# EAGLE design busadapt-revision-A (EAGLE 6.6.0)
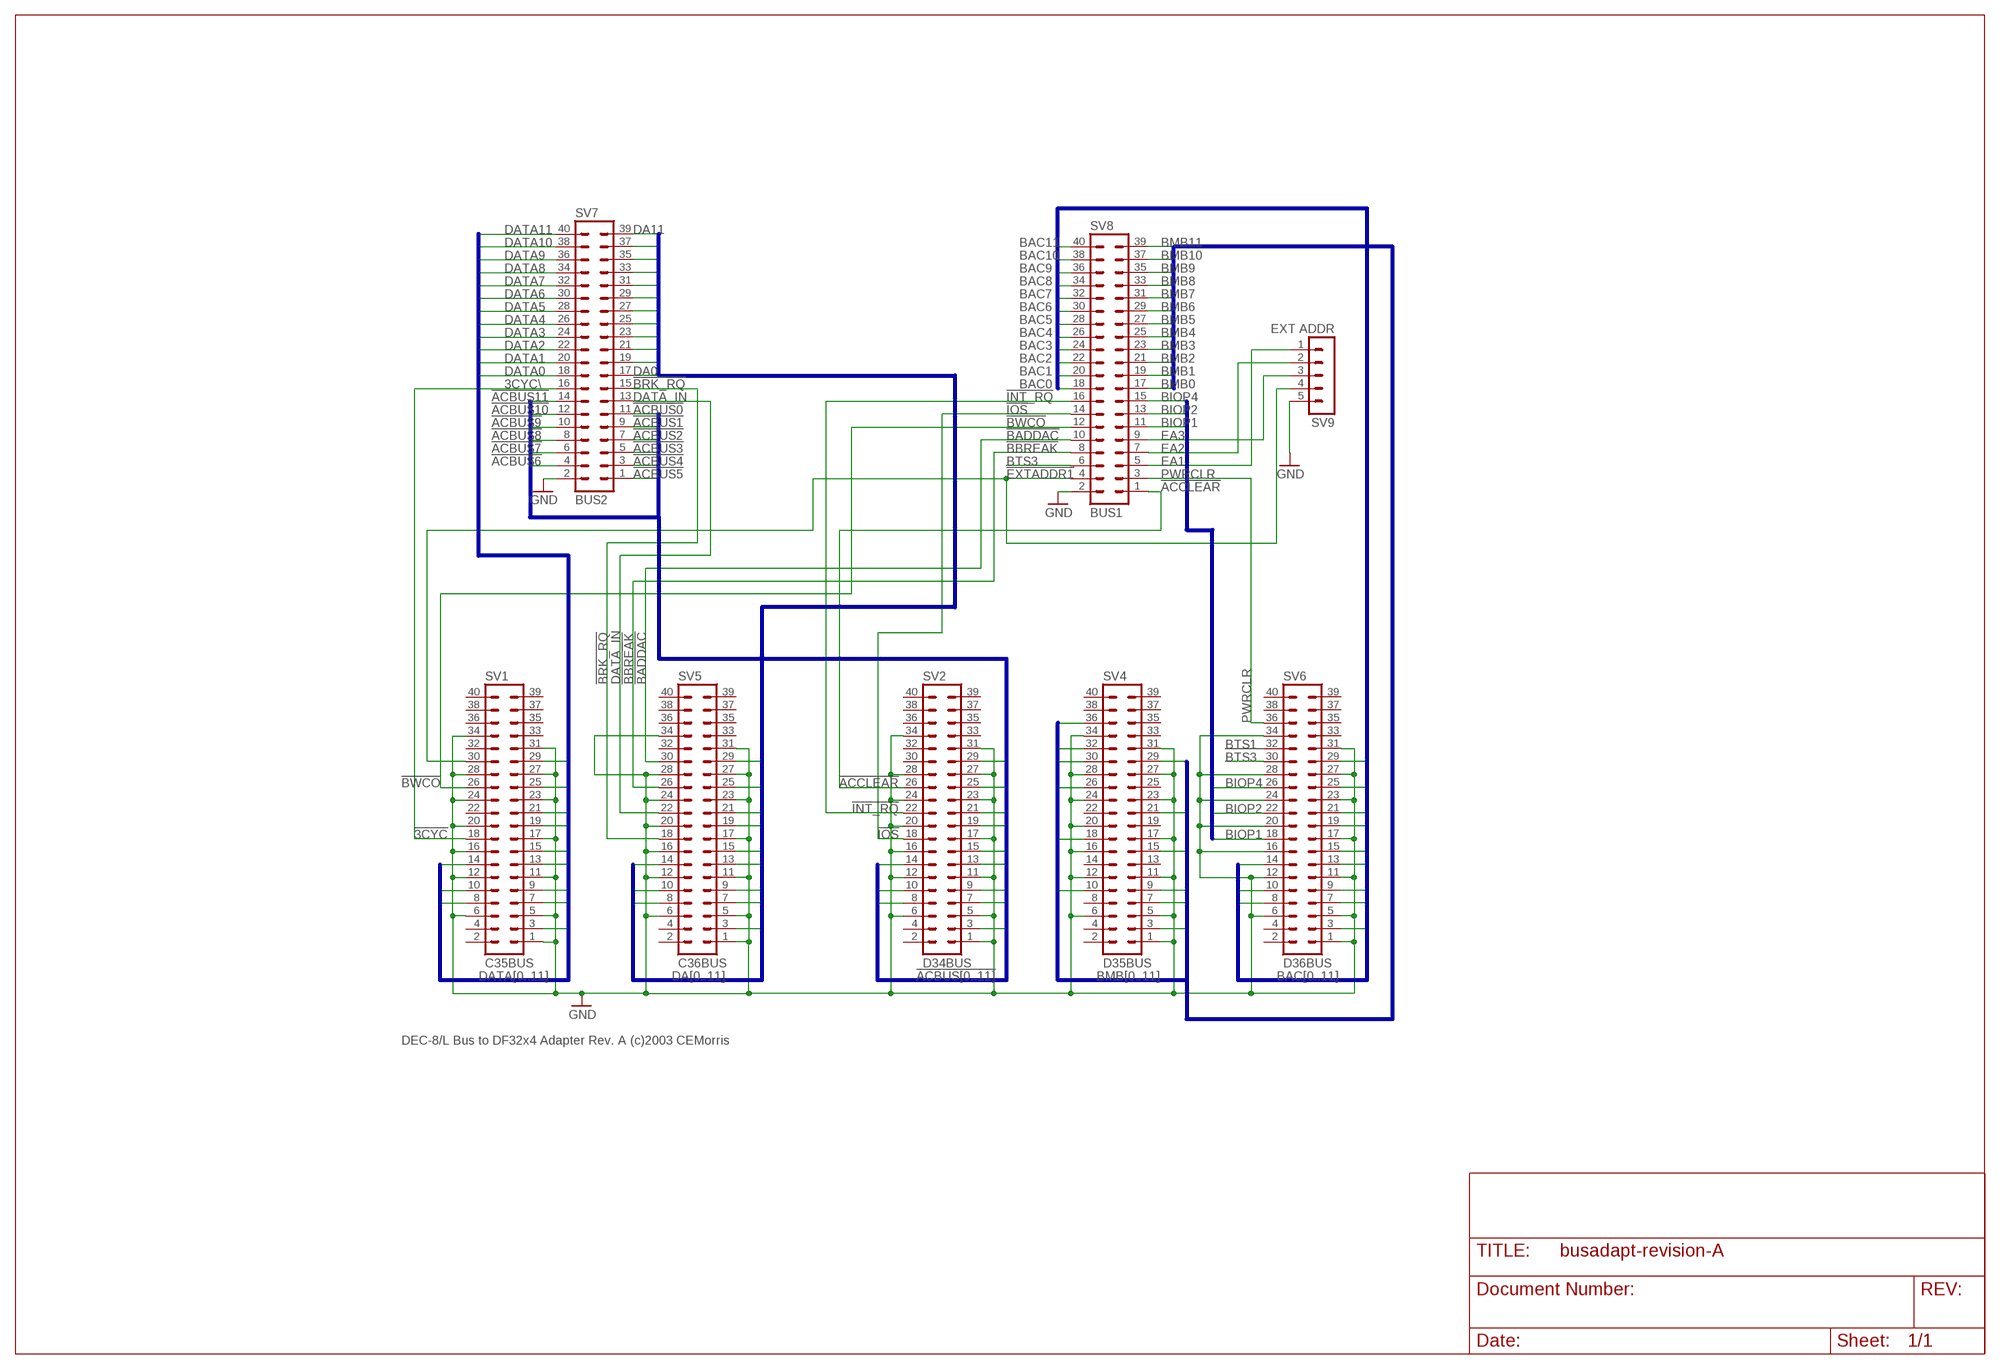
[diagram p0: schematic, sheet 1]

## Parts
SV1  C35BUS  MA20-2  [MA20-2]
SV2  D34BUS  MA20-2  [MA20-2]
SV4  D35BUS  MA20-2  [MA20-2]
SV5  C36BUS  MA20-2  [MA20-2]
SV6  D36BUS  MA20-2  [MA20-2]
SV7  BUS2  MA20-2  [MA20-2]
SV8  BUS1  MA20-2  [MA20-2]
SV9  EXT ADDR  MA05-1  [MA05-1]

## Nets
!3CYC: SV1.18 SV7.16
!ACBUS0: SV2.3 SV7.11
!ACBUS1: SV2.7 SV7.9
!ACBUS2: SV2.9 SV7.7
!ACBUS3: SV2.13 SV7.5
!ACBUS4: SV2.15 SV7.3
!ACBUS5: SV2.19 SV7.1
!ACBUS6: SV2.21 SV7.4
!ACBUS7: SV2.25 SV7.6
!ACBUS8: SV2.29 SV7.8
!ACBUS9: SV2.8 SV7.10
!ACBUS10: SV2.10 SV7.12
!ACBUS11: SV2.14 SV7.14
!ACCLEAR: SV2.26 SV8.1
!BADDAC: SV5.30 SV8.10
!BBREAK: SV5.26 SV8.8
!BRK_RQ: SV5.18 SV7.15
!BWCO: SV1.26 SV8.12
!EXTADDR1: SV1.30 SV8.4 SV9.4
!INT_RQ: SV2.22 SV8.16
!IOS: SV2.18 SV8.14
BAC0: SV6.3 SV8.18
BAC1: SV6.7 SV8.20
BAC2: SV6.9 SV8.22
BAC3: SV6.13 SV8.24
BAC4: SV6.15 SV8.26
BAC5: SV6.19 SV8.28
BAC6: SV6.21 SV8.30
BAC7: SV6.25 SV8.32
BAC8: SV6.29 SV8.34
BAC9: SV6.8 SV8.36
BAC10: SV6.10 SV8.38
BAC11: SV6.14 SV8.40
BIOP1: SV6.18 SV8.11
BIOP2: SV6.22 SV8.13
BIOP4: SV6.26 SV8.15
BMB0: SV4.3 SV8.17
BMB1: SV4.7 SV8.19
BMB2: SV4.9 SV8.21
BMB3: SV4.15 SV8.23
BMB4: SV4.21 SV8.25
BMB5: SV4.29 SV8.27
BMB6: SV4.10 SV8.29
BMB7: SV4.18 SV8.31
BMB8: SV4.26 SV8.33
BMB9: SV4.30 SV8.35
BMB10: SV4.32 SV8.37
BMB11: SV4.36 SV8.39
BTS3: SV6.30 SV8.6
DA0: SV5.3 SV7.17
DA1: SV5.7 SV7.19
DA2: SV5.9 SV7.21
DA3: SV5.13 SV7.23
DA4: SV5.15 SV7.25
DA5: SV5.19 SV7.27
DA6: SV5.21 SV7.29
DA7: SV5.25 SV7.31
DA8: SV5.29 SV7.33
DA9: SV5.8 SV7.35
DA10: SV5.10 SV7.37
DA11: SV5.14 SV7.39
DATA0: SV1.3 SV7.18
DATA1: SV1.7 SV7.20
DATA2: SV1.9 SV7.22
DATA3: SV1.13 SV7.24
DATA4: SV1.15 SV7.26
DATA5: SV1.19 SV7.28
DATA6: SV1.21 SV7.30
DATA7: SV1.25 SV7.32
DATA8: SV1.29 SV7.34
DATA9: SV1.8 SV7.36
DATA10: SV1.10 SV7.38
DATA11: SV1.14 SV7.40
DATA_IN: SV5.22 SV7.13
EA1: SV8.5 SV9.1
EA2: SV8.7 SV9.2
EA3: SV8.9 SV9.3
GND: SV1.1 SV1.5 SV1.6 SV1.11 SV1.12 SV1.16 SV1.17 SV1.20 SV1.23 SV1.24 SV1.27 SV1.28 SV1.31 SV1.34 SV2.1 SV2.5 SV2.6 SV2.11 SV2.12 SV2.16 SV2.17 SV2.20 SV2.23 SV2.24 SV2.27 SV2.28 SV2.31 SV2.34 SV4.1 SV4.5 SV4.6 SV4.11 SV4.12 SV4.16 SV4.17 SV4.20 SV4.23 SV4.24 SV4.27 SV4.28 SV4.31 SV4.34 SV5.1 SV5.5 SV5.6 SV5.11 SV5.12 SV5.16 SV5.17 SV5.20 SV5.23 SV5.24 SV5.27 SV5.28 SV5.31 SV5.34 SV6.1 SV6.5 SV6.6 SV6.11 SV6.12 SV6.16 SV6.17 SV6.20 SV6.23 SV6.24 SV6.27 SV6.28 SV6.31 SV6.34 SV7.2 SV8.2 SV9.5
PWRCLR: SV6.36 SV8.3
Unconnected: SV1.2 SV1.4 SV1.22 SV1.32 SV1.33 SV1.35 SV1.36 SV1.37 SV1.38 SV1.39 SV1.40 SV2.2 SV2.4 SV2.30 SV2.32 SV2.33 SV2.35 SV2.36 SV2.37 SV2.38 SV2.39 SV2.40 SV4.2 SV4.4 SV4.8 SV4.13 SV4.14 SV4.19 SV4.22 SV4.25 SV4.33 SV4.35 SV4.37 SV4.38 SV4.39 SV4.40 SV5.2 SV5.4 SV5.32 SV5.33 SV5.35 SV5.36 SV5.37 SV5.38 SV5.39 SV5.40 SV6.2 SV6.4 SV6.32 SV6.33 SV6.35 SV6.37 SV6.38 SV6.39 SV6.40

## Buses
DA[0..11]
BAC[0..11]
DATA[0..11]
BMB[0..11]
BIOP[1..4]
!ACBUS[0..11]

## Notes on the sheet
- DA11
- DA0
- 3CYC\\
- BTS1
- DEC-8/L Bus to DF32x4 Adapter Rev. A (c)2003 CEMorris

## Library data of the parts
SV1 SV2 SV4-SV8 = con-lstb:MA20-2: PIN HEADER; OC_FARNELL: unknown; OC_NEWARK: unknown
SV9 = con-lstb:MA05-1: PIN HEADER; OC_FARNELL: unknown; OC_NEWARK: unknown

## Board
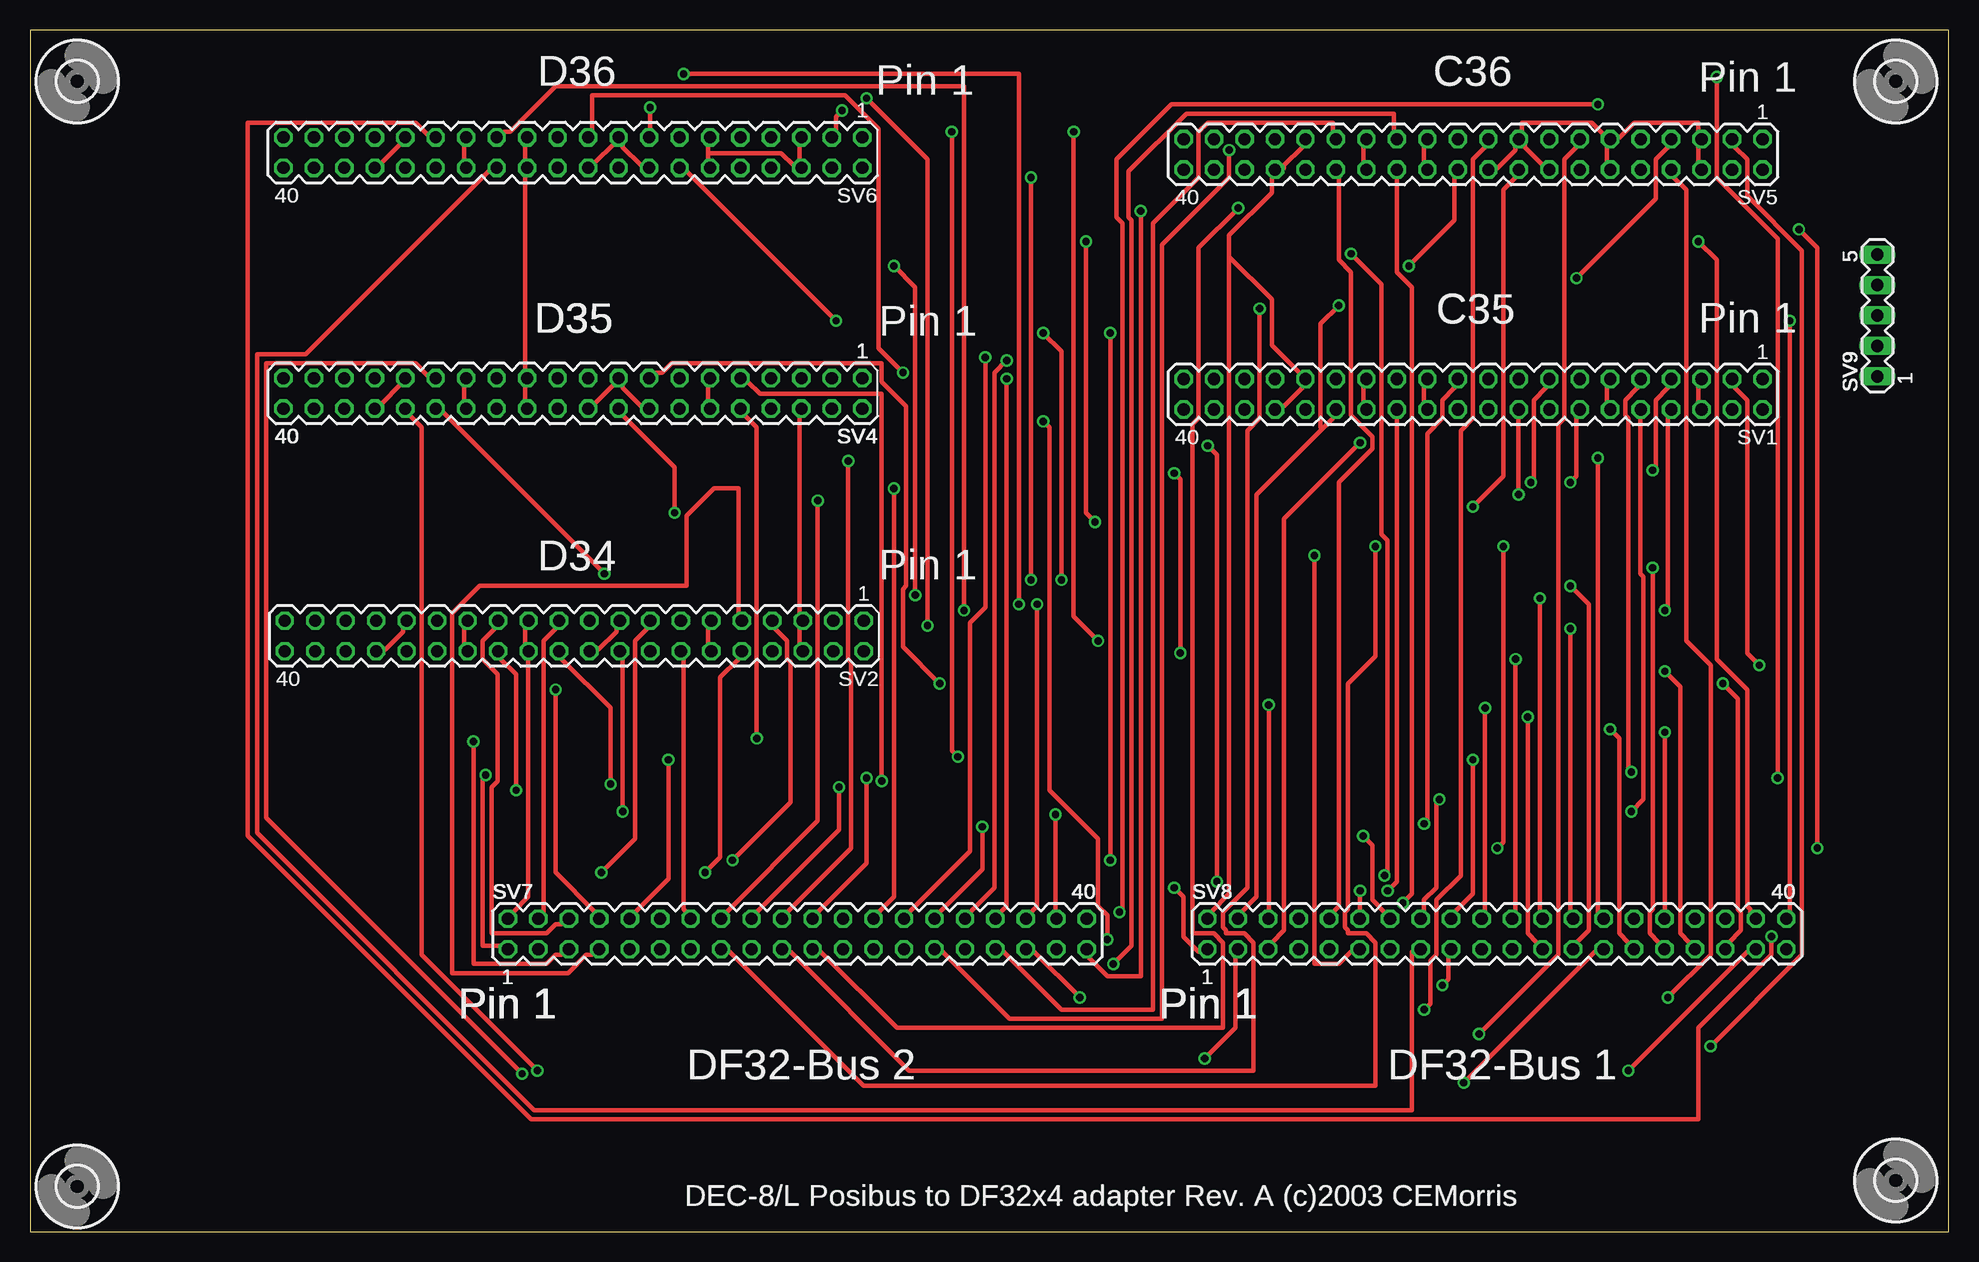
[diagram p1: board, top side]
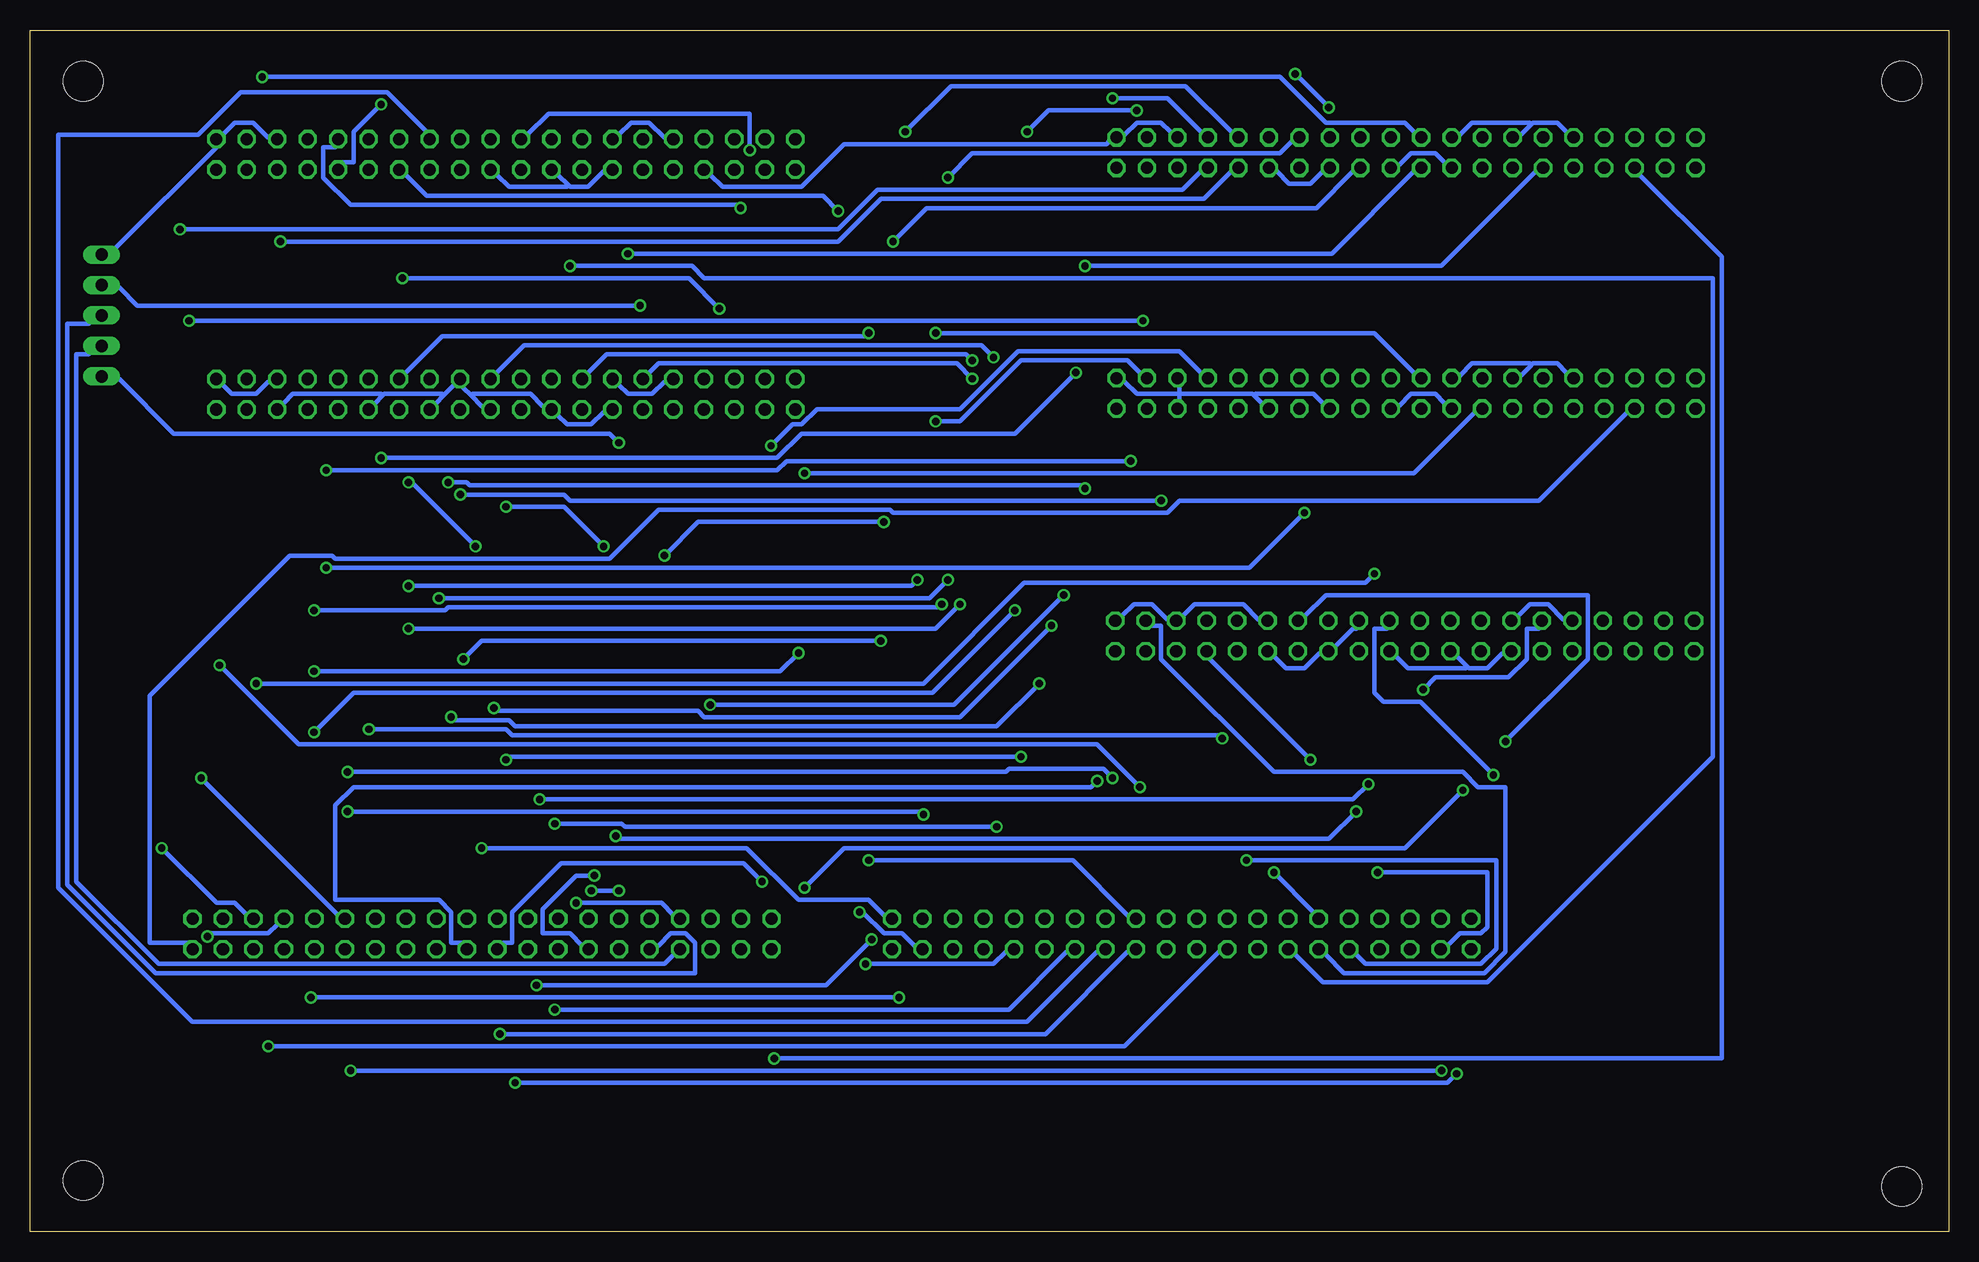
[diagram p2: board, bottom side, seen from below]

Size 159.95 x 100.15 mm. Coordinates in mm from the lower left corner, seen from the top.
Outline: 0,0 159.95,0 159.95,100.15 0,100.15 0,0
Copper layers (1*16): Top 0.035mm / dielectric 1.5mm / Bottom 0.035mm
Design rules "10mils": minimum track width 15mil, minimum drill 24mil, track to track 10mil, track to pad 10mil, pad to pad 10mil, via to via 10mil, smd to smd 10mil, copper to edge 40mil, drill to drill 10mil, minimum pad ring 10mil, minimum via ring 8mil, stop-mask expansion 0mil, vias tented up to drill 0mil, thermal gap 10mil

### Footprints (pad centres in the part's own frame; a part is rotated, then mirrored left to right if it is on the bottom)
MA20-2 = drill 1.016 octagon: 1 -24.13,-1.27; 2 -24.13,1.27; 3 -21.59,-1.27; 4 -21.59,1.27; 5 -19.05,-1.27; 6 -19.05,1.27; 7 -16.51,-1.27; 8 -16.51,1.27; 9 -13.97,-1.27; 10 -13.97,1.27; 11 -11.43,-1.27; 12 -11.43,1.27; 13 -8.89,-1.27; 14 -8.89,1.27; 15 -6.35,-1.27; 16 -6.35,1.27; 17 -3.81,-1.27; 18 -3.81,1.27; 19 -1.27,-1.27; 20 -1.27,1.27; 21 1.27,-1.27; 22 1.27,1.27; 23 3.81,-1.27; 24 3.81,1.27; 25 6.35,-1.27; 26 6.35,1.27; 27 8.89,-1.27; 28 8.89,1.27; 29 11.43,-1.27; 30 11.43,1.27; 31 13.97,-1.27; 32 13.97,1.27; 33 16.51,-1.27; 34 16.51,1.27; 35 19.05,-1.27; 36 19.05,1.27; 37 21.59,-1.27; 38 21.59,1.27; 39 24.13,-1.27; 40 24.13,1.27
MA05-1 = drill 1.016 long: 1 -5.08,0; 2 -2.54,0; 3 0,0; 4 2.54,0; 5 5.08,0
3,3 = hole 3.3: 0,0

### Placement (x,y rotation side)
SV1  120.29,69.79 180 top
SV2  45.36,49.66 180 top
SV4  45.25,69.87 180 top
SV5  120.29,89.79 180 top
SV6  45.25,89.93 180 top
SV7  63.96,24.82 0 top
SV8  122.27,24.82 0 top
SV9  153.98,76.36 90 top
U$1  [3,3]  3.94,3.78 0 top
U$2  [3,3]  3.94,95.87 0 top
U$3  [3,3]  155.52,95.87 0 top
U$4  [3,3]  155.52,4.28 0 top

### Tracks (layer width: path | path; a pad name or v marks a point on that pad's centre or on a via)
!3CYC  (via drill 0.61)
  Top 0.381: v65.66,60.93 65.66,34.26 58.04,26.64 SV7.16 | v124.08,61.44 124.08,67.79 SV1.18
  Bottom 0.381: v65.66,60.93 114.94,60.93 115.45,61.44 v124.08,61.44
!ACBUS0
  Bottom 0.381: SV7.11 51.95,23.08 50.42,21.56 38.74,21.56 36.96,23.34 36.96,37.05 39.25,37.05 40.52,38.32 56.26,38.32 65.66,47.72 65.66,50.52 66.42,50.52 SV2.3
!ACBUS1  (via drill 0.61)
  Top 0.381: v58.55,30.96 63.38,35.78 63.38,47.47 63.12,47.72 63.12,49.25 62.11,50.26 SV2.7
  Bottom 0.381: v58.55,30.96 37.72,30.96 37.72,23.59 38.99,22.32 48.64,22.32 49.41,23.08 SV7.9
!ACBUS2
  Top 0.381: SV7.7 46.87,23.08 46.36,23.08 44.83,21.56 35.18,21.56 35.18,51.53 37.47,53.82 54.74,53.82 54.74,59.66 57.03,61.95 59.06,61.95 59.06,51.53 SV2.9
!ACBUS3  (via drill 0.61)
  Top 0.381: v36.96,40.86 36.96,22.32 43.06,22.32 43.82,23.08 44.33,23.08 SV7.5
  Bottom 0.381: v36.96,40.86 30.1,47.72 30.1,53.06 51.95,53.06 53.72,51.28 SV2.13
!ACBUS4  (via drill 0.61)
  Top 0.381: v47.63,29.94 50.42,32.74 50.42,49.25 51.44,50.26 SV2.15
  Bottom 0.381: v47.63,29.94 38.48,29.94 38.48,25.37 38.99,24.86 40.77,24.86 41.79,23.85 SV7.3
!ACBUS5  (via drill 0.61)
  Top 0.381: v37.98,38.07 37.72,37.82 37.72,23.85 39.25,23.85 SV7.1
  Bottom 0.381: v37.98,38.07 44.07,44.17 47.12,44.17 47.88,44.93 47.88,50.26 46.87,50.26 SV2.19
!ACBUS6
  Top 0.381: SV7.4 42.8,26.64 42.8,49.25 43.82,50.26 SV2.21
!ACBUS7
  Top 0.381: SV7.6 44.33,25.62 43.82,25.62 43.06,24.86 38.48,24.86 38.48,37.05 38.99,37.56 38.99,46.45 37.72,47.72 37.72,49.25 38.74,50.26 SV2.25
!ACBUS8  (via drill 0.61)
  Top 0.381: v43.82,45.18 43.82,29.94 47.12,26.64 SV7.8
  Bottom 0.381: v43.82,45.18 42.8,46.2 36.71,46.2 35.18,47.72 35.18,50.26 34.17,50.26 SV2.29
!ACBUS9  (via drill 0.61)
  Top 0.381: v53.22,39.34 53.22,29.43 50.42,26.64 SV7.10
  Bottom 0.381: v53.22,39.34 61.6,47.72 SV2.8
!ACBUS10  (via drill 0.61)
  Top 0.381: v56.26,29.94 57.53,31.21 57.53,46.2 59.06,47.72 SV2.10
  Bottom 0.381: v56.26,29.94 52.96,26.64 SV7.12
!ACBUS11
  Top 0.381: SV7.14 54.74,26.64 54.49,26.89 54.49,47.72 SV2.14
!ACCLEAR  (via drill 0.61)
  Top 0.381: v40.52,36.8 40.52,46.45 39.25,47.72 SV2.26 | v95.38,28.67 96.14,27.91 96.14,24.61 97.41,23.34 SV8.1
  Bottom 0.381: v40.52,36.8 45.34,31.97 92.08,31.97 v95.38,28.67
!BADDAC
  Top 0.381: SV8.10 108.59,26.64 109.1,27.15 109.1,62.45 111.89,65.25 111.89,66.26 110.11,68.04 110.11,79.98 109.1,81 109.1,87.85 SV5.30
!BBREAK  (via drill 0.61)
  Top 0.381: v114.43,27.4 115.19,28.16 115.19,78.71 113.92,79.98 113.92,87.85 SV5.26
  Bottom 0.381: v114.43,27.4 107.32,27.4 106.3,26.39 SV8.8
!BRK_RQ  (via drill 0.61)
  Top 0.381: v112.14,57.12 112.14,47.98 109.86,45.69 109.86,26.89 109.6,26.64 109.6,25.37 109.86,25.12 109.86,24.86 111.38,24.86 112.14,24.1 112.14,12.16 69.47,12.16 58.3,23.34 SV7.15 | v120.27,60.42 122.81,62.96 122.81,86.84 123.83,87.85 SV5.18
  Bottom 0.381: v112.14,57.12 115.45,60.42 v120.27,60.42
!BWCO  (via drill 0.61)
  Top 0.381: v110.87,28.42 110.87,26.64 SV8.12 | v113.16,28.42 113.92,29.18 113.92,67.79 SV1.26
  Bottom 0.381: v110.87,28.42 v113.16,28.42
!EXTADDR1  (via drill 0.61)
  Top 0.381: 107.7,66.9 108.59,67.79 SV1.30 | 107.7,66.9 102.24,61.44 102.24,27.91 100.97,26.64 SV8.4 | v109.1,77.19 107.57,75.66 107.57,67.03 107.7,66.9
  Bottom 0.381: v109.1,77.19 151.01,77.19 152.53,78.71 SV9.4
!INT_RQ  (via drill 0.61)
  Top 0.381: v48.39,37.31 48.39,43.66 44.33,47.72 SV2.22 | v117.48,36.04 117.22,35.78 117.22,28.67 116.21,27.66 116.21,26.64 SV8.16
  Bottom 0.381: v48.39,37.31 49.66,36.04 v117.48,36.04
!IOS  (via drill 0.61)
  Top 0.381: v49.41,35.02 49.41,47.72 SV2.18 | v111.13,32.99 111.89,32.23 111.89,27.66 112.91,26.64 SV8.14
  Bottom 0.381: v49.41,35.02 51.69,32.74 110.87,32.74 v111.13,32.99
BAC0  (via drill 0.61)
  Top 0.381: v120.27,39.34 120.27,28.16 118.75,26.64 SV8.18 | v77.35,39.59 76.84,40.1 v76.84,91.66 | v67.69,93.44 67.19,92.93 67.19,91.92 SV6.3
  Bottom 0.381: v120.27,39.34 120.02,39.59 v77.35,39.59 | v76.84,91.66 75.06,93.44 v67.69,93.44
BAC1  (via drill 0.61)
  Top 0.381: v121.29,43.66 121.29,26.64 SV8.20 | v74.81,50.52 74.81,89.38 v69.73,94.46
  Bottom 0.381: v121.29,43.66 121.03,43.4 104.27,43.4 103.76,42.9 82.43,42.9 v74.81,50.52 | v69.73,94.46 65.15,94.46 62.36,91.66 SV6.7
BAC2  (via drill 0.61)
  Top 0.381: v123.83,47.72 123.83,26.64 SV8.22 | v89.03,49.25 87,51.28 v87,91.66
  Bottom 0.381: v123.83,47.72 122.3,49.25 v89.03,49.25 | v87,91.66 83.19,95.47 63.63,95.47 59.82,91.66 SV6.9
BAC3  (via drill 0.61)
  Top 0.381: v83.44,54.33 v83.44,87.85 | v125.86,52.8 125.86,26.64 SV8.24
  Bottom 0.381: v83.44,87.85 81.41,89.89 55.76,89.89 54.74,90.9 SV6.13 | v83.44,54.33 84.97,52.8 v125.86,52.8
BAC4  (via drill 0.61)
  Top 0.381: v51.69,93.7 51.69,91.92 SV6.15 | v54.49,96.49 82.43,96.49 v82.43,52.29 | v128.4,50.26 128.4,26.64 SV8.26
  Bottom 0.381: v54.49,96.49 v51.69,93.7 | v82.43,52.29 84.46,50.26 v128.4,50.26
BAC5  (via drill 0.61)
  Top 0.381: v130.69,64.49 130.69,26.64 SV8.28 | v72.77,71.6 70.74,73.63 70.74,91.92 67.95,94.71 46.87,94.71 46.87,91.92 SV6.19
  Bottom 0.381: v130.69,64.49 97.67,64.49 95.63,66.52 77.85,66.52 v72.77,71.6
BAC6  (via drill 0.61)
  Top 0.381: v145.67,37.82 145.67,82.77 140.59,87.85 v140.59,96.24
  Bottom 0.381: v145.67,37.82 134.24,26.39 SV8.30 | v140.59,96.24 55.76,96.24 51.95,92.43 45.34,92.43 44.58,91.66 SV6.21
BAC7  (via drill 0.61)
  Top 0.381: v77.85,51.79 77.85,95.47 43.82,95.47 40.01,91.66 39.5,91.66 SV6.25 | v136.27,41.63 136.27,26.64 SV8.32
  Bottom 0.381: v77.85,51.79 84.71,44.93 132.97,44.93 v136.27,41.63
BAC8  (via drill 0.61)
  Top 0.381: v145.16,24.61 145.16,23.08 139.07,16.99 139.07,9.37 41.79,9.37 18.16,32.99 18.16,92.43 32.13,92.43 33.15,91.41 SV6.29
  Bottom 0.381: v145.16,24.61 144.91,24.86 140.08,24.86 139.32,25.62 SV8.34
BAC9  (via drill 0.61)
  Top 0.381: v147.45,83.54 148.97,82.01 v148.97,31.97
  Bottom 0.381: v147.45,83.54 92.59,83.54 89.28,86.84 63.88,86.84 62.36,88.36 SV6.8 | v148.97,31.97 144.4,27.4 142.88,27.4 141.86,26.39 SV8.36
BAC10  (via drill 0.61)
  Top 0.381: v139.07,82.52 140.59,81 140.59,47.72 143.13,45.18 143.13,27.15 143.39,26.89 143.39,26.64 SV8.38
  Bottom 0.381: v139.07,82.52 92.59,82.52 89.03,86.08 62.11,86.08 59.82,88.36 SV6.10
BAC11  (via drill 0.61)
  Top 0.381: v67.19,75.92 54.74,88.36 SV6.14 | v146.69,75.92 146.69,26.64 SV8.40
  Bottom 0.381: v67.19,75.92 v146.69,75.92
BIOP1  (via drill 0.61)
  Top 0.381: v107.06,56.36 107.06,22.32 109.1,22.32 110.11,23.34 SV8.11 | v88.78,59.15 88.01,59.91 v88.01,82.52
  Bottom 0.381: v107.06,56.36 104.27,59.15 v88.78,59.15 | v88.01,82.52 85.22,85.31 52.71,85.31 49.66,88.36 SV6.18
BIOP2  (via drill 0.61)
  Top 0.381: v110.11,81.5 112.65,78.96 112.65,58.14 113.16,57.63 113.16,29.94 v112.91,29.69
  Bottom 0.381: v110.11,81.5 51.44,81.5 44.58,88.36 SV6.22 | v112.91,29.69 114.43,29.69 117.22,26.89 117.22,24.86 114.94,24.86 113.92,23.85 SV8.13
BIOP4
  Top 0.381: SV6.26 38.23,88.36 22.99,73.12 18.93,73.12 18.93,33.24 42.04,10.13 115.19,10.13 115.19,23.34 SV8.15
BMB0  (via drill 0.61)
  Top 0.381: v84.46,67.53 84.97,67.03 84.97,36.8 89.03,32.74 89.03,27.15 89.79,26.39 v89.79,24.35 | v117.73,20.54 118.24,21.05 118.24,22.83 SV8.17
  Bottom 0.381: v84.46,67.53 82.43,67.53 77.35,72.61 68.46,72.61 67.44,71.6 SV4.3 | v89.79,24.35 93.6,20.54 v117.73,20.54
BMB1  (via drill 0.61)
  Top 0.381: v98.17,65.5 98.94,64.74 v98.94,29.18
  Bottom 0.381: v98.17,65.5 96.4,67.28 95.63,67.28 94.36,68.55 82.43,68.55 77.6,73.38 64.14,73.38 62.36,71.6 SV4.7 | v98.94,29.18 100.46,30.7 115.7,30.7 119.76,26.64 119.76,24.1 120.53,24.1 SV8.19
BMB2  (via drill 0.61)
  Top 0.381: v71,37.56 71,69.82 60.84,69.82 59.82,70.84 SV4.9
  Bottom 0.381: v71,37.56 71.5,37.05 132.97,37.05 134.5,35.53 134.5,27.66 125.86,27.66 124.84,26.64 124.84,24.1 123.83,24.1 SV8.21
BMB3  (via drill 0.61)
  Top 0.381: v75.82,45.69 72.77,48.74 72.77,53.56 73.03,53.82 73.03,68.8 71,70.84 71,72.36 53.47,72.36 52.71,71.6 52.2,71.6 SV4.15 | v124.84,42.9 124.84,24.86 125.61,24.1 SV8.23
  Bottom 0.381: v75.82,45.69 79.38,42.13 119.51,42.13 120.02,42.64 124.59,42.64 v124.84,42.9
BMB4  (via drill 0.61)
  Top 0.381: v84.46,74.9 85.98,73.38 v85.98,54.33 | v128.4,53.82 129.92,52.29 129.92,25.12 128.91,24.1 SV8.25
  Bottom 0.381: v84.46,74.9 47.88,74.9 44.58,71.6 SV4.21 | v85.98,54.33 86.49,53.82 v128.4,53.82
BMB5  (via drill 0.61)
  Top 0.381: v41.02,13.18 19.69,34.51 19.69,72.36 32.13,72.36 33.15,71.34 SV4.29 | v119.51,12.42 130.43,23.34 SV8.27
  Bottom 0.381: v41.02,13.18 41.79,12.42 v119.51,12.42
BMB6  (via drill 0.61)
  Top 0.381: v60.58,41.12 60.58,67.03 59.57,68.04 SV4.10 | v131.7,41.88 132.46,41.12 132.46,24.86 133.23,24.1 SV8.29
  Bottom 0.381: v60.58,41.12 60.84,41.37 119.76,41.37 120.27,41.88 v131.7,41.88
BMB7  (via drill 0.61)
  Top 0.381: v53.72,59.91 53.72,63.72 49.41,68.04 SV4.18 | v135.26,55.34 135.26,26.89 135,26.64 135,24.86 135.77,24.1 SV8.31
  Bottom 0.381: v53.72,59.91 58.3,55.34 v135.26,55.34
BMB8  (via drill 0.61)
  Top 0.381: v95.38,63.22 95.89,62.71 v95.89,48.23 | v136.27,46.71 137.54,45.44 137.54,24.86 138.31,24.1 SV8.33
  Bottom 0.381: v95.38,63.22 44.58,63.22 39.5,68.3 SV4.26 | v95.89,48.23 97.41,46.71 v136.27,46.71
BMB9  (via drill 0.61)
  Top 0.381: v47.88,54.83 34.42,68.3 SV4.30 | v141.1,45.69 142.37,44.42 142.37,26.89 142.62,26.64 142.62,25.12 141.61,24.1 SV8.35
  Bottom 0.381: v47.88,54.83 48.64,54.07 77.09,54.07 85.47,45.69 v141.1,45.69
BMB10  (via drill 0.61)
  Top 0.381: v42.29,13.43 32.64,23.08 32.64,67.03 31.63,68.04 SV4.32 | v133.23,13.43 143.13,23.34 SV8.37
  Bottom 0.381: v42.29,13.43 v133.23,13.43
BMB11
  Bottom 0.381: SV4.36 26.8,68.3 34.17,60.93 64.14,60.93 65.15,59.91 88.01,59.91 88.27,60.17 107.57,60.17 111.64,56.1 134.5,56.1 134.75,56.36 138.31,56.36 149.99,44.67 149.99,24.1 146.69,24.1 SV8.39
BTS3  (via drill 0.61)
  Top 0.381: v72.01,80.49 73.79,78.71 v73.79,53.06 | v103.25,43.91 103.25,26.64 SV8.6
  Bottom 0.381: v72.01,80.49 42.29,80.49 34.42,88.36 SV6.30 | v73.79,53.06 82.93,43.91 v103.25,43.91
DA0  (via drill 0.61)
  Top 0.381: v140.08,15.46 147.7,23.08 147.7,81.76 143.13,86.33 143.13,89.38 142.12,90.39 SV5.3
  Bottom 0.381: v140.08,15.46 68.71,15.46 60.84,23.34 SV7.17
DA1  (via drill 0.61)
  Top 0.381: v102.49,76.93 102.49,67.79 101.48,66.77 101.48,28.67 99.44,26.64 99.44,25.37 99.7,25.12 99.7,24.86 101.22,24.86 101.98,24.1 101.98,13.43 73.28,13.43 63.38,23.34 SV7.19 | v128.91,79.47 135.51,86.08 135.51,89.38 136.53,90.39 SV5.7
  Bottom 0.381: v102.49,76.93 105.03,79.47 v128.91,79.47
DA2  (via drill 0.61)
  Top 0.381: v100.71,85.31 97.41,82.01 97.41,67.79 96.9,67.28 96.9,24.86 98.68,24.86 99.44,24.1 99.44,16.99 72.27,16.99 65.92,23.34 SV7.21
  Bottom 0.381: v100.71,85.31 100.97,85.57 133.23,85.57 135.51,87.85 135.51,90.39 134.5,90.39 SV5.9
DA3  (via drill 0.61)
  Top 0.381: v120.78,16.48 127.38,23.08 127.38,67.28 127.89,67.79 127.89,89.38 128.91,90.39 SV5.13
  Bottom 0.381: v120.78,16.48 75.31,16.48 68.46,23.34 SV7.23
DA4
  Bottom 0.381: SV7.25 71,23.34 76.84,17.5 146.43,17.5 157.61,28.67 157.61,91.41 145.93,91.41 142.37,94.97 130.18,94.97 126.88,91.66 SV5.15
DA5  (via drill 0.61)
  Top 0.381: v116.21,18.51 116.72,19.02 116.72,22.58 117.22,23.08 117.22,27.66 119.26,29.69 119.26,66.77 120.27,67.79 120.27,89.38 121.29,90.39 SV5.19
  Bottom 0.381: v116.21,18.51 78.36,18.51 73.54,23.34 SV7.27
DA6  (via drill 0.61)
  Top 0.381: v99.95,90.14 99.95,87.85 94.36,82.27 94.36,17.75 81.66,17.75 76.08,23.34 SV7.29
  Bottom 0.381: v99.95,90.14 99.95,93.19 116.72,93.19 118.49,91.41 SV5.21
DA7  (via drill 0.61)
  Top 0.381: v90.3,22.32 91.82,23.85 91.82,84.3 91.57,84.55 91.57,88.36 96.4,93.19 113.67,93.19 113.67,91.66 SV5.25
  Bottom 0.381: v90.3,22.32 79.63,22.32 78.62,23.34 SV7.31
DA8
  Top 0.381: SV7.33 81.16,23.34 85.98,18.51 93.6,18.51 93.6,84.04 97.41,87.85 97.41,91.66 98.17,92.43 108.59,92.43 108.59,91.66 SV5.29
DA9  (via drill 0.61)
  Top 0.381: v87.51,19.53 83.7,23.34 SV7.35 | v136.53,19.53 140.08,23.08 140.08,47.21 138.05,49.25 138.05,86.84 137.04,87.85 SV5.8
  Bottom 0.381: v87.51,19.53 v136.53,19.53
DA10  (via drill 0.61)
  Top 0.381: v90.81,26.64 91.06,26.89 91.06,84.04 90.55,84.55 90.55,89.38 95.13,93.95 v130.69,93.95
  Bottom 0.381: v90.81,26.64 90.55,26.64 88.78,24.86 87.25,24.86 86.24,23.85 SV7.37 | v130.69,93.95 132.97,91.66 132.97,89.12 133.99,89.12 SV5.10
DA11  (via drill 0.61)
  Top 0.381: v92.59,85.06 92.59,21.31 89.79,21.31 88.27,22.83 SV7.39
  Bottom 0.381: v92.59,85.06 93.86,86.33 126.88,86.33 128.65,88.11 SV5.14
DATA0  (via drill 0.61)
  Top 0.381: v67.44,37.05 67.44,33.5 60.58,26.64 SV7.18 | v144.15,47.21 143.13,48.23 143.13,69.31 142.12,70.33 SV1.3
  Bottom 0.381: v67.44,37.05 71,40.61 137.54,40.61 v144.15,47.21
DATA1  (via drill 0.61)
  Top 0.381: v68.2,64.23 68.2,47.72 68.46,47.47 68.46,31.97 63.12,26.64 SV7.20 | v135.26,63.47 135.51,63.72 135.51,69.31 136.53,70.33 SV1.7
  Bottom 0.381: v68.2,64.23 96.9,64.23 97.67,63.47 v135.26,63.47
DATA2  (via drill 0.61)
  Top 0.381: v69.73,37.82 69.73,30.7 65.66,26.64 SV7.22 | v133.48,38.32 133.23,38.58 133.23,67.79 132.97,68.04 132.97,69.31 133.99,70.33 SV1.9
  Bottom 0.381: v69.73,37.82 70.49,38.58 78.36,38.58 78.62,38.32 v133.48,38.32
DATA3  (via drill 0.61)
  Top 0.381: v90.05,30.96 v90.05,74.9
  Bottom 0.381: v90.05,30.96 73.03,30.96 68.46,26.39 SV7.24 | v90.05,74.9 90.3,74.65 125.61,74.65 128.65,71.6 SV1.13
DATA4  (via drill 0.61)
  Top 0.381: v72.01,61.95 72.01,27.91 70.74,26.64 SV7.26 | v125.1,62.45 125.35,62.71 125.35,69.31 126.37,70.33 SV1.15
  Bottom 0.381: v72.01,61.95 72.27,62.2 123.32,62.2 123.57,62.45 v125.1,62.45
DATA5  (via drill 0.61)
  Top 0.381: v79.63,72.87 79.63,52.04 78.36,50.77 78.36,31.72 73.28,26.64 SV7.28
  Bottom 0.381: v79.63,72.87 80.65,73.88 118.75,73.88 121.03,71.6 SV1.19
DATA6  (via drill 0.61)
  Top 0.381: v79.38,33.75 79.38,30.2 75.82,26.64 SV7.30 | v116.21,34.01 116.46,34.26 116.46,66.52 117.73,67.79 117.73,69.31 118.75,70.33 SV1.21
  Bottom 0.381: v79.38,33.75 110.37,33.75 110.62,34.01 v116.21,34.01
DATA7  (via drill 0.61)
  Top 0.381: v81.41,72.61 80.39,71.6 80.39,28.67 78.36,26.64 SV7.32
  Bottom 0.381: v81.41,72.61 81.92,73.12 111.89,73.12 113.41,71.6 SV1.25
DATA8  (via drill 0.61)
  Top 0.381: v81.41,71.09 81.41,27.15 80.9,26.64 SV7.34
  Bottom 0.381: v81.41,71.09 82.68,72.36 107.57,72.36 108.33,71.6 SV1.29
DATA9  (via drill 0.61)
  Top 0.381: v83.95,52.29 83.95,27.15 83.44,26.64 SV7.36 | v136.27,51.79 136.53,52.04 136.53,67.79 SV1.8
  Bottom 0.381: v83.95,52.29 84.2,52.04 125.1,52.04 125.35,51.79 v136.27,51.79
DATA10  (via drill 0.61)
  Top 0.381: v85.47,34.77 85.47,26.64 SV7.38 | v133.48,35.02 134.5,36.04 134.5,54.58 134.24,54.83 134.24,67.79 SV1.10
  Bottom 0.381: v85.47,34.77 85.73,35.02 v133.48,35.02
DATA11  (via drill 0.61)
  Top 0.381: v122.3,31.97 122.81,32.48 v122.81,57.12 | v128.4,62.45 128.91,62.96 128.91,67.79 SV1.14
  Bottom 0.381: v122.3,31.97 100.21,31.97 95.89,27.66 90.05,27.66 88.78,26.39 SV7.40 | v122.81,57.12 128.15,62.45 v128.4,62.45
DATA_IN  (via drill 0.61)
  Top 0.381: v114.94,80.49 118.75,84.3 118.75,87.85 SV5.22
  Bottom 0.381: v114.94,80.49 104.78,80.49 103.76,79.47 19.69,79.47 19.69,39.59 38.48,20.8 52.2,20.8 54.49,23.08 SV7.13
EA1  (via drill 0.61)
  Top 0.381: v110.87,65.76 104.52,59.41 104.52,25.12 103.51,24.1 SV8.5
  Bottom 0.381: v110.87,65.76 111.64,66.52 147.96,66.52 152.53,71.09 SV9.1
EA2
  Bottom 0.381: SV8.7 106.3,23.08 107.06,22.32 149.23,22.32 156.09,29.18 156.09,73.12 155.07,73.12 SV9.2
EA3
  Bottom 0.381: SV8.9 107.57,23.85 106.56,24.86 105.29,24.86 104.52,24.1 104.52,21.56 149.48,21.56 156.85,28.93 156.85,75.66 155.07,75.66 SV9.3
GND
  Top 0.381: SV4.24 41.28,69.31 41.28,70.58 SV4.23 41.28,71.85 41.28,88.11 SV6.24 41.28,89.38 41.28,90.65 SV6.23 | SV4.28 36.2,69.31 36.2,70.58 SV4.27 | SV4.34 29.34,69.06 30.86,70.58 SV4.31 | SV4.20 47.12,69.06 48.64,70.58 SV4.17 49.41,70.58 49.41,70.33 50.93,68.8 SV4.16 | SV4.12 56.52,69.31 56.52,70.58 SV4.11 | SV6.28 36.2,89.38 36.2,90.65 SV6.27 | SV6.34 29.34,89.12 30.86,90.65 SV6.31 | SV6.5 64.14,90.65 64.14,89.38 SV6.6 63.63,88.87 62.61,89.89 56.52,89.89 | 56.52,89.89 56.52,90.65 SV6.11 | 56.52,89.89 56.52,89.38 SV6.12 | SV6.20 47.12,89.12 48.64,90.65 SV6.17 49.41,90.65 49.41,90.39 50.93,88.87 SV6.16 | SV2.6 64.14,48.99 64.14,50.26 SV2.5 64.14,51.53 64.14,68.04 SV4.6 | SV2.12 56.52,48.99 56.52,50.26 SV2.11 | SV2.20 47.37,48.48 48.9,50.01 48.9,50.26 SV2.17 | SV2.34 29.59,48.48 31.12,50.01 31.12,50.26 SV2.31 | SV2.28 36.2,48.99 36.2,50.26 SV2.27 | SV7.2 40.26,26.64 41.53,27.91 41.53,47.72 SV2.24 41.28,48.99 41.28,50.26 SV2.23 | SV1.34 104.52,68.8 106.05,70.33 SV1.31 105.79,71.6 103.51,73.88 103.51,77.69 99.95,81.25 | SV1.28 111.13,69.06 111.13,70.33 SV1.27 | SV1.24 116.21,69.06 116.21,70.33 SV1.23 | SV1.6 139.07,69.06 139.07,70.33 SV1.5 | SV1.12 131.45,69.06 131.45,70.33 SV1.11 | SV5.12 131.45,89.12 131.45,90.39 SV5.11 | SV5.6 139.07,89.12 139.07,90.39 SV5.5 139.07,91.66 139.07,92.43 133.73,92.43 132.46,91.16 SV5.11 | SV5.20 122.3,88.62 123.83,90.14 123.83,90.39 SV5.17 | SV5.16 126.11,88.87 124.59,90.39 124.59,90.65 SV5.17 | SV5.28 111.13,89.12 111.13,90.39 SV5.27 | SV5.24 116.21,89.12 116.21,90.39 SV5.23 | 99.95,81.25 99.95,83.03 103.51,86.58 103.51,87.85 SV5.34 104.52,88.62 104.52,88.87 106.05,90.39 SV5.31
  Top 0.381: 99.95,81.25 99.95,28.16 98.43,26.64 SV8.2 | SV5.11 131.19,91.41 130.18,92.43 124.34,92.43 124.34,91.66 SV5.17
  Bottom 0.381: 34.8,72.23 34.67,72.36 32.64,72.36 31.88,71.6 SV4.31 | 34.8,72.23 35.69,71.34 SV4.27 | SV4.23 40.77,71.34 39.75,72.36 34.93,72.36 34.8,72.23 | 64.14,69.82 64.14,70.58 SV4.5 | 64.14,69.82 64.14,69.31 SV4.6 | 64.14,69.82 67.69,69.82 68.71,70.84 SV4.1 | 57.91,69.69 58.04,69.82 64.14,69.82 | 57.91,69.69 57.28,69.06 SV4.12 | SV4.16 52.2,69.06 52.96,69.82 57.79,69.82 57.91,69.69 | SV4.24 42.04,69.06 42.8,69.82 44.83,69.82 45.85,68.8 SV4.20 | 34.8,92.3 34.67,92.43 32.64,92.43 31.88,91.66 SV6.31 | 34.8,92.3 35.69,91.41 SV6.27 | SV6.23 40.77,91.41 39.75,92.43 34.93,92.43 34.8,92.3 | SV6.5 64.9,91.66 65.66,92.43 67.69,92.43 68.71,91.41 SV6.1 69.98,90.9 70.23,90.65 92.08,90.65 95.63,87.09 102.24,87.09 103.25,88.11 SV5.34 | SV6.12 56.01,88.36 54.99,87.35 53.22,87.35 52.2,88.36 SV6.16 | SV6.24 42.04,89.12 42.8,89.89 44.83,89.89 45.85,88.87 SV6.20 | SV2.1 68.96,51.28 67.95,52.29 66.42,52.29 65.15,51.02 SV2.5 63.88,51.28 62.87,52.29 58.8,52.29 57.53,51.02 SV2.11 | SV2.17 49.41,50.26 49.66,50.26 51.18,48.74 SV2.16 52.45,48.23 53.72,46.96 55.25,46.96 56.26,47.98 SV2.12 | 40.14,47.09 41.02,47.98 SV2.24 | 40.14,47.09 40.01,46.96 38.48,46.96 37.21,48.23 SV2.28 | SV2.31 32.13,51.02 33.4,52.29 34.93,52.29 35.94,51.28 SV2.27 | SV2.20 46.1,47.98 45.09,46.96 40.26,46.96 40.14,47.09 | SV1.28 112.14,68.3 113.16,67.28 115.19,67.28 115.95,68.04 SV1.24 117.22,68.8 118.24,69.82 123.07,69.82 123.19,69.69 | SV1.31 107.06,70.84 108.08,69.82 110.11,69.82 110.87,70.58 SV1.27 | SV1.1 143.89,70.58 143.13,69.82 141.1,69.82 140.08,70.84 SV1.5 | 123.19,69.69 123.83,70.33 SV1.17 124.59,70.58 125.48,69.69
  Bottom 0.381: 123.19,69.69 122.3,68.8 SV1.20 | 125.48,69.69 126.11,69.06 SV1.16 | 130.56,69.69 130.43,69.82 125.61,69.82 125.48,69.69 | 130.56,69.69 131.19,69.06 SV1.12 | SV1.6 138.81,69.06 138.05,69.82 130.69,69.82 130.56,69.69 | SV5.5 140.08,91.16 141.35,92.43 142.88,92.43 143.89,91.41 SV5.1 144.4,90.39 152.78,82.01 SV9.5 | 115.06,87.22 115.95,88.11 SV5.24 | 115.06,87.22 114.94,87.09 113.41,87.09 112.14,88.36 SV5.28 | SV5.20 121.03,88.11 120.02,87.09 115.19,87.09 115.06,87.22 | SV5.27 110.87,91.41 109.86,92.43 108.33,92.43 107.06,91.16 SV5.31
PWRCLR  (via drill 0.61)
  Top 0.381: v97.92,14.45 100.46,16.99 100.46,22.83 SV8.3
  Bottom 0.381: v97.92,14.45 18.93,14.45 18.93,81.25 25.78,88.11 SV6.36

### Text on the board
tPlace: 1 | 1 | 40 | 40 | 5 | 5 | 5 | 5 | 5 | 5 | 5 | 5 | 5 | 5 | 5 | 5 | 5 | 5 | 5 | 1 | 1 | 1 | 1 | 1 | 1 | 1 | 1 | 1 | 1 | 1 | 1 | 1 | 1 | 1 | 1 | 1 | 1 | 1 | 1 | 1 | 1 | 1 | 1 | 1 | 1 | 1 | 1 | 1 | 1 | 1 | 40 | 40 | 40 | 40 | 40 | 40 | 40 | 40 | 40 | 40 | 40 | 40 | 40 | 40 | 40 | 40 | 1 | 40 | 40 | 40 | 40 | 40 | 40 | 40 | 40 | 40 | 40 | 40 | 40 | 40 | 40 | 40 | 40 | 40 | 40 | 40 | 40 | 40 | 40 | 40 | 40 | 40 | 40 | 40 | 40 | 40 | 40 | 40 | 1 | 1 | 1 | 1 | 1 | 1 | 1 | 1 | 1 | 1 | 1 | 1 | 1 | 1 | 1 | 1 | 1 | 1 | 1 | 1 | 1 | 1 | 1 | 1 | 1 | 1 | 1 | 1 | 1 | 1
tNames: D36 | D36 | C36 | C36 | Pin 1 | Pin 1 | SV6 | SV5 | C35 | C35 | D35 | D35 | D35 | D35 | D35 | D35 | D35 | D35 | D35 | D35 | D35 | D35 | D35 | D35 | Pin 1 | Pin 1 | SV9 | SV9 | SV9 | SV9 | SV9 | SV9 | SV9 | SV9 | SV9 | SV9 | SV9 | SV9 | SV9 | SV9 | SV9 | SV4 | SV4 | SV4 | SV4 | SV4 | SV4 | SV4 | SV4 | SV4 | SV4 | SV4 | SV4 | SV4 | SV4 | SV4 | SV1 | D34 | D34 | Pin 1 | SV2 | SV7 | SV7 | SV7 | SV7 | SV7 | SV7 | SV7 | SV7 | SV7 | SV7 | SV7 | SV7 | SV7 | SV7 | SV7 | SV8 | SV8 | SV8 | SV8 | SV8 | SV8 | SV8 | SV8 | SV8 | SV8 | SV8 | SV8 | SV8 | SV8 | SV8 | Pin 1 | Pin 1 | Pin 1 | Pin 1 | Pin 1 | Pin 1 | Pin 1 | Pin 1 | Pin 1 | Pin 1 | Pin 1 | Pin 1 | Pin 1 | Pin 1 | Pin 1 | Pin 1 | Pin 1 | Pin 1 | Pin 1 | Pin 1 | Pin 1 | Pin 1 | Pin 1 | Pin 1 | Pin 1 | Pin 1 | Pin 1 | Pin 1 | Pin 1 | Pin 1 | Pin 1 | Pin 1 | DF32-Bus 2 | DF32-Bus 2 | DF32-Bus 1 | DF32-Bus 1 | DEC-8/L Posibus to DF32x4 adapter Rev. A (c)2003 CEMorris | DEC-8/L Posibus to DF32x4 adapter Rev. A (c)2003 CEMorris
tValues: D36BUS | C36BUS | D35BUS | D35BUS | D35BUS | D35BUS | D35BUS | D35BUS | D35BUS | D35BUS | D35BUS | D35BUS | D35BUS | D35BUS | D35BUS | D35BUS | D35BUS | C35BUS | EXT ADDR | EXT ADDR | EXT ADDR | EXT ADDR | EXT ADDR | EXT ADDR | EXT ADDR | EXT ADDR | EXT ADDR | EXT ADDR | EXT ADDR | EXT ADDR | EXT ADDR | EXT ADDR | EXT ADDR | D34BUS | BUS2 | BUS2 | BUS2 | BUS2 | BUS2 | BUS2 | BUS2 | BUS2 | BUS2 | BUS2 | BUS2 | BUS2 | BUS2 | BUS2 | BUS2 | BUS1 | BUS1 | BUS1 | BUS1 | BUS1 | BUS1 | BUS1 | BUS1 | BUS1 | BUS1 | BUS1 | BUS1 | BUS1 | BUS1 | BUS1